# Altium schematic sheet motor.SchDoc
size A
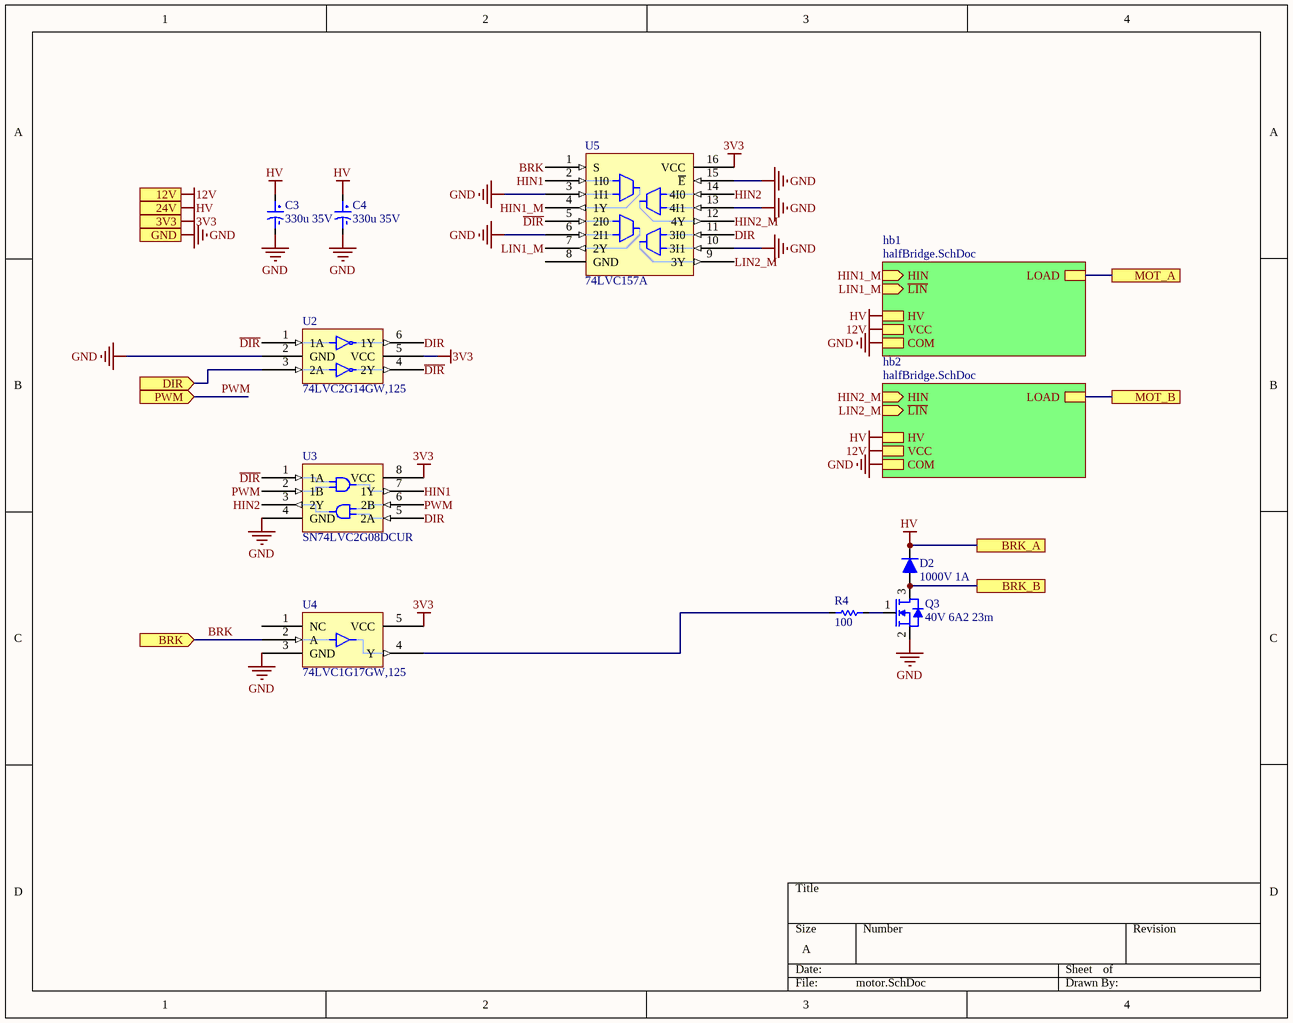
[diagram p0: motor.SchDoc]

## Parts
C3  330u 35V  [CAP ALUM 10X10]
C4  330u 35V  [CAP ALUM 10X10]
D2  1000V 1A  [DIOM4426X30M]
Q3  40V 6A2 23m  [SOT457_FET]
R4  100  [RES 0603 L]
U2  74LVC2G14GW,125  [SOT363]
U3  SN74LVC2G08DCUR  [VSSOP-8]
U4  74LVC1G17GW,125  [SOT753]
U5  74LVC157A  [TSSOP-16]

## Sub-sheets
hb1 = halfBridge.SchDoc: HIN (in), ~{LIN} (in), LOAD, COM, HV, VCC
hb2 = halfBridge.SchDoc: HIN (in), ~{LIN} (in), LOAD, COM, HV, VCC

## Ports
3V3, 12V, 24V, BRK (in), BRK_A, BRK_B, DIR (in), GND, MOT_A, MOT_B, PWM (in)

## Nets
3V3: U2.5(VCC) U3.8(VCC) U4.5(VCC) U5.16(VCC) ; port 3V3
12V: port 12V, sheet hb1/VCC, sheet hb2/VCC
GND: C3.2 C4.2 Q3.2 U2.2(GND) U3.4(GND) U4.3(GND) U5.3(1I1) U5.6(2I1) U5.10(3I1) U5.13(4I1) U5.15(~{E}) ; port GND, sheet hb1/COM, sheet hb2/COM
HV: C3.1 C4.1 D2.2 ; port 24V, port BRK_A, sheet hb1/HV, sheet hb2/HV
BRK: U4.2(A) U5.1(S) ; port BRK
BRK_B: D2.1 Q3.3 ; port BRK_B
~{DIR}: U2.1(1A) U2.4(2Y) U3.1(1A) U5.5(2I0)
DIR: U2.6(1Y) U3.5(2A) U5.11(3I0)
DIR: U2.3(2A) ; port DIR  [a separate net that carries the same name]
HIN1: U3.7(1Y) U5.2(1I0)
HIN1_M: U5.4(1Y) ; sheet hb1/HIN
HIN2: U3.3(2Y) U5.14(4I0)
HIN2_M: U5.12(4Y) ; sheet hb2/HIN
LIN1_M: U5.7(2Y) ; sheet hb1/~{LIN}
LIN2_M: U5.9(3Y) ; sheet hb2/~{LIN}
MOT_A: port MOT_A, sheet hb1/LOAD
MOT_B: port MOT_B, sheet hb2/LOAD
PWM: U3.2(1B) U3.6(2B) ; port PWM
NetQ3_1: Q3.1 R4.2
NetR4_1: R4.1 U4.4(Y)

Not connected (* = marked no-connect by the designer): U4 1(NC); U5 8(GND)

## Library data of the parts
C3 C4 = CAP 330uF 35V: PANASONIC ELECTRONIC COMPONENTS         EEE1VA331P             SMD Aluminium Electrolytic Capacitor, Radial Can - SMD, 330 F, 35 V, S Series; Manufacturer Part Number 1: EEE-1VA331P; Polarity: Polar; Life (Hours): 2000Hour; Leakage Current: 3uA; Capacitance: 330uF; Ripple Current (AC): 350mA; Tolerance: 20%; Supplier 1: Digi-Key; Supplier Part Number 1: PCE3959CT-ND; Manufacturer 1: Panasonic; RoHS: Yes; Category: Aluminum Electrolytic Capacitors; Stock 1: 45237; Pricing 1: 1=0.73000, 10=0.51400, 50=0.38880, 100=0.33860 (USD); Mount: Surface Mount,PCB; Case/Package: Radial; Contact Plating: Tin; Min Operating Temperature: -40°C; Max Operating Temperature: 85°C; Termination: SMD/SMT; Voltage: 35V; Voltage Rating: 35V; Packaging: Tape and Reel; Ripple Current: 350mA; Voltage Rating (DC): 35V; Package Quantity: 500; Diameter: 10mm; Length: 10.5mm; Height: 10.2mm; Height - Seated (Max): 0.402inch; Radiation Hardening: No; Lead Free: Lead Free; REACH SVHC: No SVHC; ComponentLink1URL: https://datasheet.ciiva.com/16389/aba0000ce2-16389541.pdf?src-supplier=Future+Electronics; ComponentLink1Description: https://datasheet.ciiva.com/16389/aba0000ce2-16389541.pdf?src-supplier=Future+Electronics; ComponentLink2URL: https://datasheet.ciiva.com/30235/11aba0000ce2-30235093.pdf?src-supplier=Onlinecomponents.com; ComponentLink2Description: https://datasheet.ciiva.com/30235/11aba0000ce2-30235093.pdf?src-supplier=Onlinecomponents.com; ComponentLink3URL: https://datasheet.ciiva.com/46374/aba0000ce2-46374421.pdf?src-supplier=Element14; ComponentLink3Description: https://datasheet.ciiva.com/46374/aba0000ce2-46374421.pdf?src-supplier=Element14; ComponentLink4URL: https://datasheet.ciiva.com/43470/aba0000ce2-43470694.pdf?src-supplier=Farnell; ComponentLink4Description: https://datasheet.ciiva.com/43470/aba0000ce2-43470694.pdf?src-supplier=Farnell; ComponentLink5URL: https://datasheet.ciiva.com/14593/70255710-14593929.pdf?src-supplier=Allied+Electronics; ComponentLink5Description: https://datasheet.ciiva.com/14593/70255710-14593929.pdf?src-supplier=Allied+Electronics; ComponentLink6URL: https://datasheet.ciiva.com/24025/aba0000ce2-40801-24025561.pdf?src-supplier=Mouser; ComponentLink6Description: https://datasheet.ciiva.com/24025/aba0000ce2-40801-24025561.pdf?src-supplier=Mouser; ComponentLink7URL: https://datasheet.ciiva.com/14599/70255710-14599770.pdf?src-supplier=Allied+Electronics; ComponentLink7Description: https://datasheet.ciiva.com/14599/70255710-14599770.pdf?src-supplier=Allied+Electronics; ComponentLink8URL: https://datasheet.ciiva.com/17534/aba0000ce2-17534540.pdf?src-supplier=Avnet+Europe; ComponentLink8Description: https://datasheet.ciiva.com/17534/aba0000ce2-17534540.pdf?src-supplier=Avnet+Europe; ComponentLink9URL: https://datasheet.ciiva.com/31414/aba0000ce2-31414702.pdf?src-supplier=Farnell; ComponentLink9Description: https://datasheet.ciiva.com/31414/aba0000ce2-31414702.pdf?src-supplier=Farnell
D2 = DIODE 1000V 1A: S1MTR
Q3 = FET 40V 6A2 23mR: PMN20ENAX
R4 = RES 0603
U2 = IC NOT 2CH
U3 = IC AND2 2CH
U4 = IC BUF 1CH
U5 = IC MUX 4CH 2:1: 74LVC157APW; Supplier 1: Digi-Key; Supplier Part Number 1: 1727-4028-1-ND